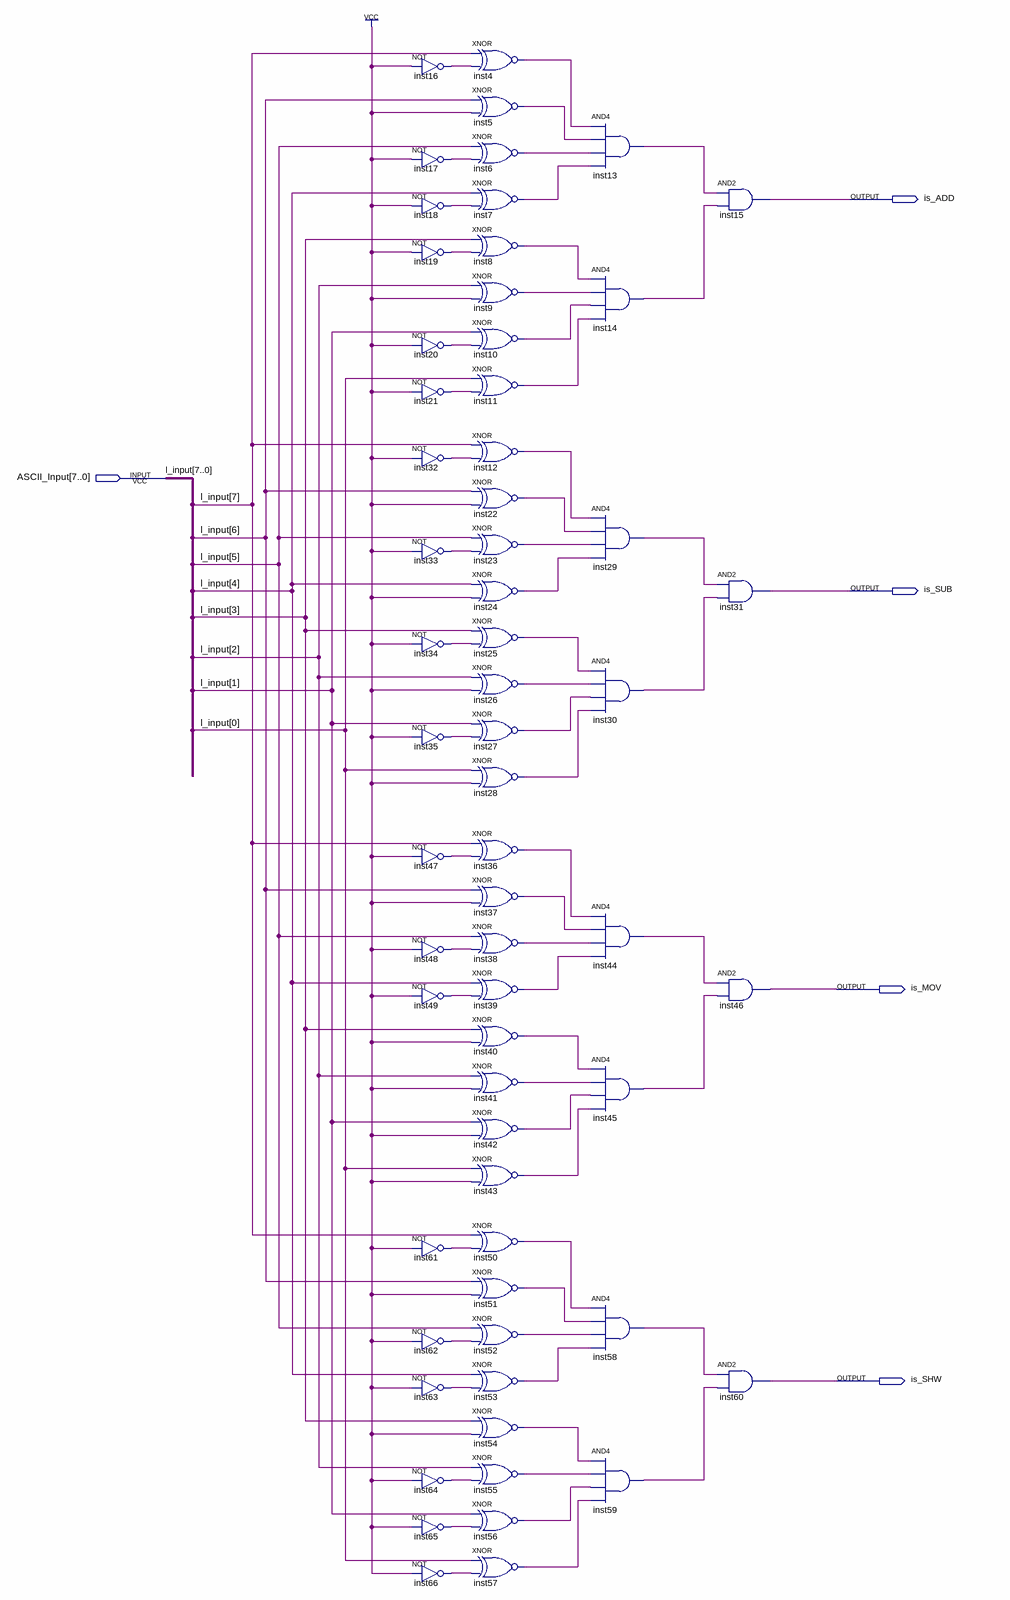
[diagram p0: schematic sheet]
// Quartus schematic ascii_comparator.bdf as structural Verilog: 63 symbols, 5 pins
module ascii_comparator (
  input  [7:0] ASCII_Input,
  output is_ADD,
  output is_SUB,
  output is_MOV,
  output is_SHW
);

  wire inst4_out, inst5_out, inst6_out, inst7_out, inst8_out, inst9_out, inst10_out, inst11_out, inst12_out,
       inst13_out, inst14_out, inst16_out, inst17_out, inst18_out, inst19_out, inst20_out, inst21_out,
       inst22_out, inst23_out, inst24_out, inst25_out, inst26_out, inst27_out, inst28_out, inst29_out,
       inst30_out, inst32_out, inst33_out, inst34_out, inst35_out, inst36_out, inst37_out, inst38_out,
       inst39_out, inst40_out, inst41_out, inst42_out, inst43_out, inst44_out, inst45_out, inst47_out,
       inst48_out, inst49_out, inst50_out, inst51_out, inst52_out, inst53_out, inst54_out, inst55_out,
       inst56_out, inst57_out, inst58_out, inst59_out, inst61_out, inst62_out, inst63_out, inst64_out,
       inst65_out, inst66_out;

  not inst16 (inst16_out, 1'b1);
  not inst17 (inst17_out, 1'b1);
  not inst18 (inst18_out, 1'b1);
  not inst19 (inst19_out, 1'b1);
  not inst20 (inst20_out, 1'b1);
  not inst21 (inst21_out, 1'b1);
  not inst32 (inst32_out, 1'b1);
  not inst33 (inst33_out, 1'b1);
  not inst34 (inst34_out, 1'b1);
  not inst35 (inst35_out, 1'b1);
  not inst47 (inst47_out, 1'b1);
  not inst48 (inst48_out, 1'b1);
  not inst49 (inst49_out, 1'b1);
  not inst61 (inst61_out, 1'b1);
  not inst62 (inst62_out, 1'b1);
  not inst63 (inst63_out, 1'b1);
  not inst64 (inst64_out, 1'b1);
  not inst65 (inst65_out, 1'b1);
  not inst66 (inst66_out, 1'b1);
  xnor inst4 (inst4_out, ASCII_Input[7], inst16_out);
  xnor inst5 (inst5_out, ASCII_Input[6], 1'b1);
  xnor inst6 (inst6_out, ASCII_Input[5], inst17_out);
  xnor inst7 (inst7_out, ASCII_Input[4], inst18_out);
  xnor inst8 (inst8_out, ASCII_Input[3], inst19_out);
  xnor inst9 (inst9_out, ASCII_Input[2], 1'b1);
  xnor inst10 (inst10_out, ASCII_Input[1], inst20_out);
  xnor inst11 (inst11_out, ASCII_Input[0], inst21_out);
  xnor inst12 (inst12_out, ASCII_Input[7], inst32_out);
  xnor inst22 (inst22_out, ASCII_Input[6], 1'b1);
  xnor inst23 (inst23_out, ASCII_Input[5], inst33_out);
  xnor inst24 (inst24_out, ASCII_Input[4], 1'b1);
  xnor inst25 (inst25_out, ASCII_Input[3], inst34_out);
  xnor inst26 (inst26_out, ASCII_Input[2], 1'b1);
  xnor inst27 (inst27_out, ASCII_Input[1], inst35_out);
  xnor inst28 (inst28_out, ASCII_Input[0], 1'b1);
  xnor inst36 (inst36_out, ASCII_Input[7], inst47_out);
  xnor inst37 (inst37_out, ASCII_Input[6], 1'b1);
  xnor inst38 (inst38_out, ASCII_Input[5], inst48_out);
  xnor inst39 (inst39_out, ASCII_Input[4], inst49_out);
  xnor inst40 (inst40_out, ASCII_Input[3], 1'b1);
  xnor inst41 (inst41_out, ASCII_Input[2], 1'b1);
  xnor inst42 (inst42_out, ASCII_Input[1], 1'b1);
  xnor inst43 (inst43_out, ASCII_Input[0], 1'b1);
  xnor inst50 (inst50_out, ASCII_Input[7], inst61_out);
  xnor inst51 (inst51_out, ASCII_Input[6], 1'b1);
  xnor inst52 (inst52_out, ASCII_Input[5], inst62_out);
  xnor inst53 (inst53_out, ASCII_Input[4], inst63_out);
  xnor inst54 (inst54_out, ASCII_Input[3], 1'b1);
  xnor inst55 (inst55_out, ASCII_Input[2], inst64_out);
  xnor inst56 (inst56_out, ASCII_Input[1], inst65_out);
  xnor inst57 (inst57_out, ASCII_Input[0], inst66_out);
  and inst13 (inst13_out, inst4_out, inst5_out, inst6_out, inst7_out);
  and inst14 (inst14_out, inst8_out, inst9_out, inst10_out, inst11_out);
  and inst29 (inst29_out, inst12_out, inst22_out, inst23_out, inst24_out);
  and inst30 (inst30_out, inst25_out, inst26_out, inst27_out, inst28_out);
  and inst44 (inst44_out, inst36_out, inst37_out, inst38_out, inst39_out);
  and inst45 (inst45_out, inst40_out, inst41_out, inst42_out, inst43_out);
  and inst58 (inst58_out, inst50_out, inst51_out, inst52_out, inst53_out);
  and inst59 (inst59_out, inst54_out, inst55_out, inst56_out, inst57_out);
  and inst15 (is_ADD, inst13_out, inst14_out);
  and inst31 (is_SUB, inst29_out, inst30_out);
  and inst46 (is_MOV, inst44_out, inst45_out);
  and inst60 (is_SHW, inst58_out, inst59_out);

  // Other names for the same wires on the sheet: l_input[7:0] = ASCII_Input
endmodule
